# EasyEDA Pro project ProProject_开关电源实验平台_2024-07-17.epro, board PCB6
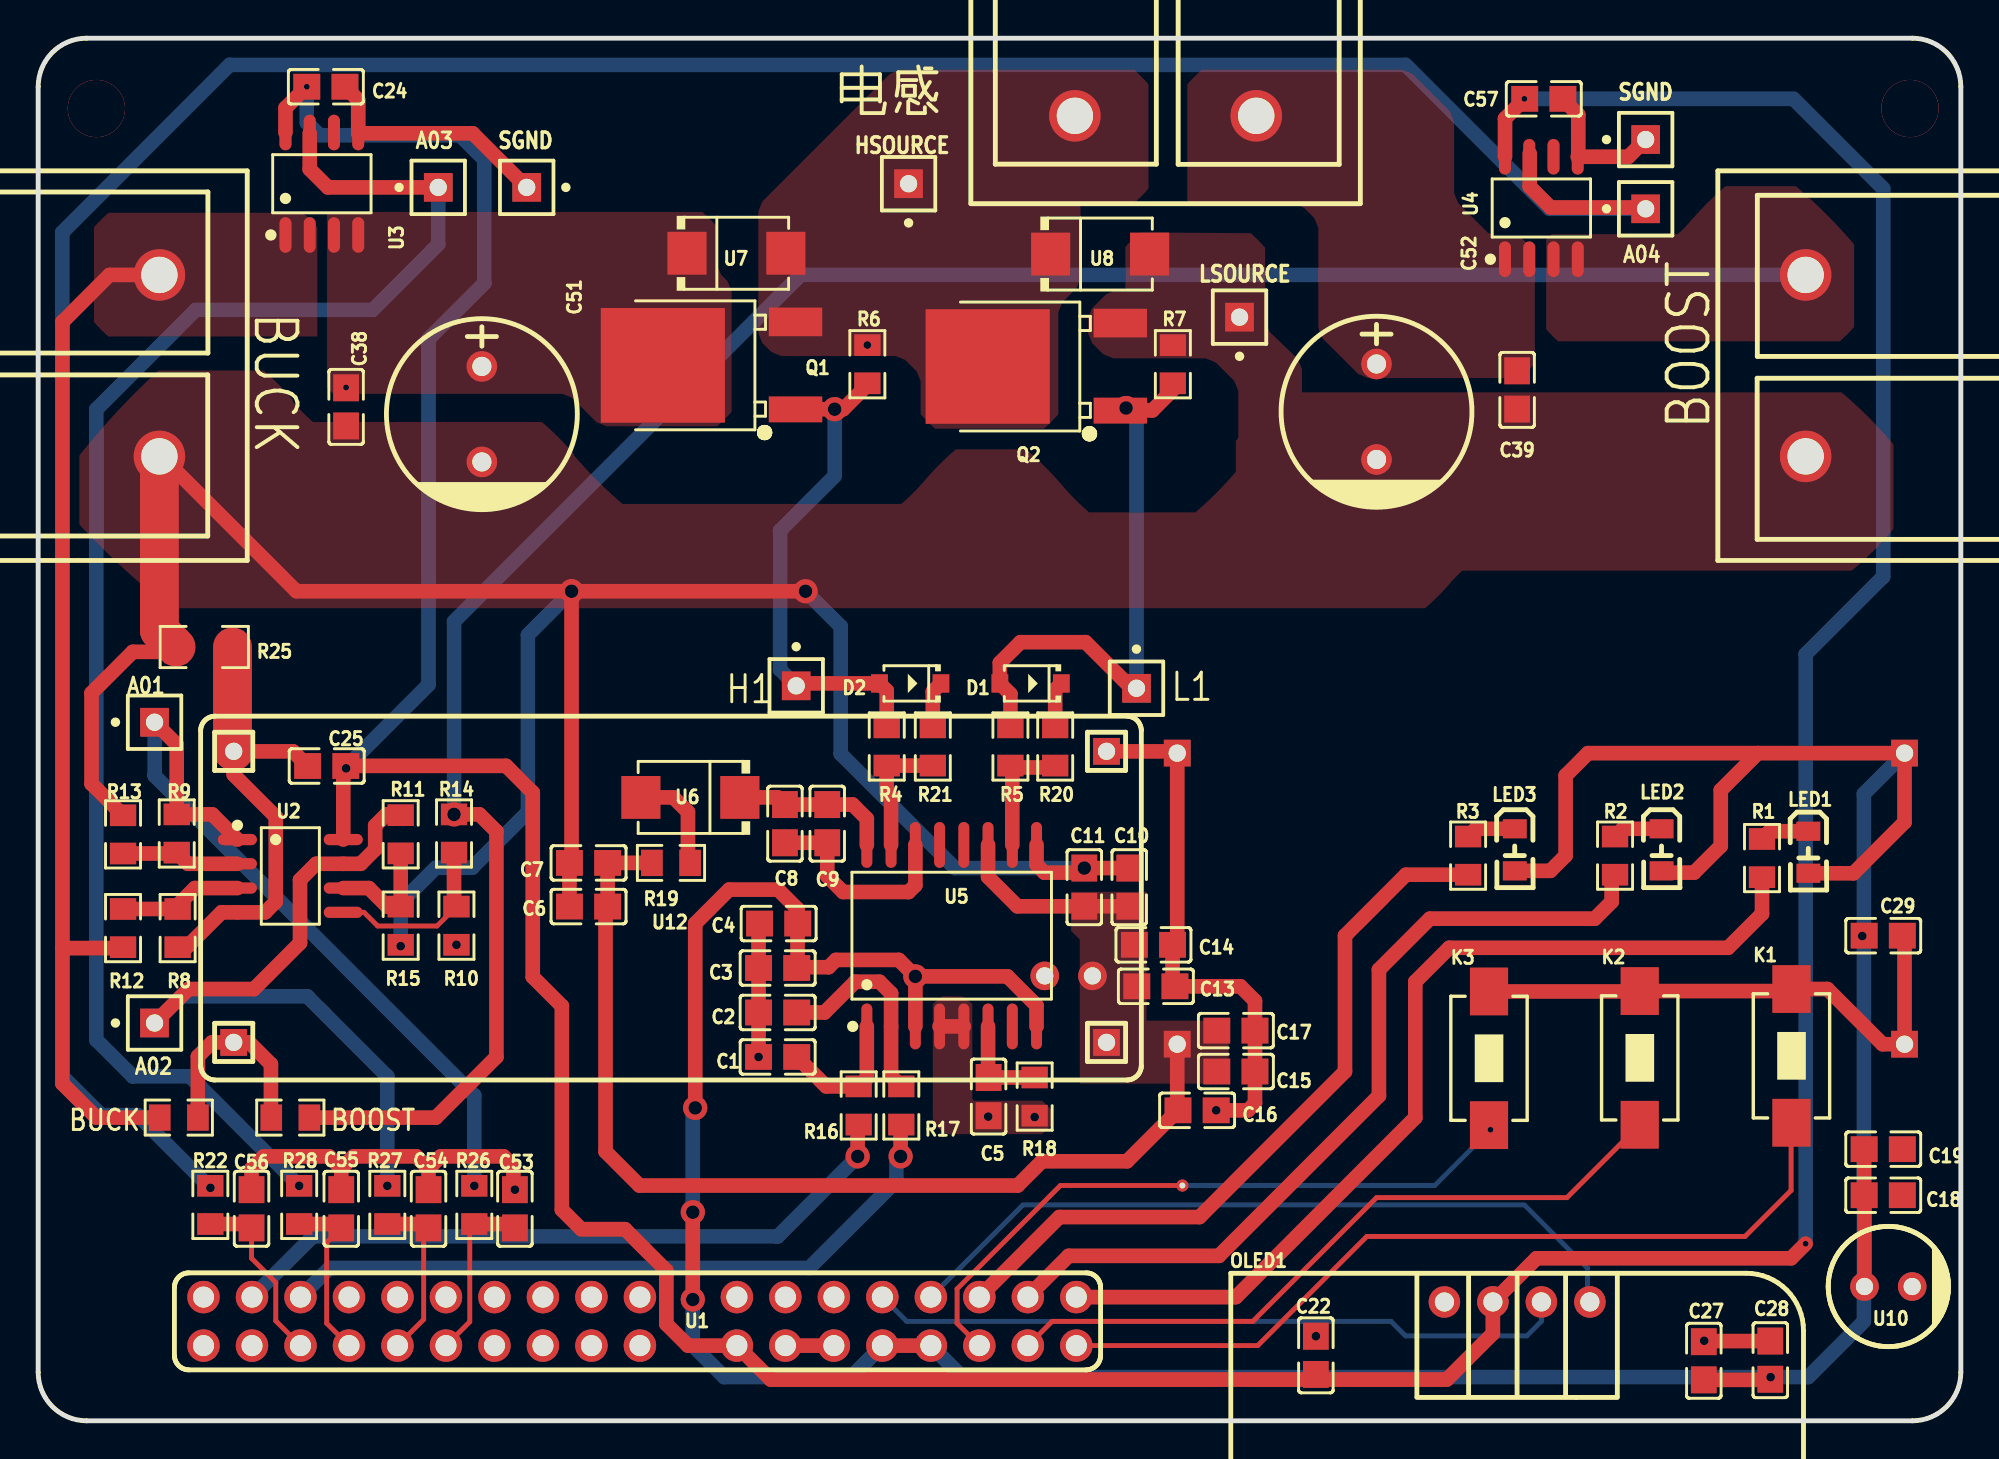
[diagram p8: board, top side]
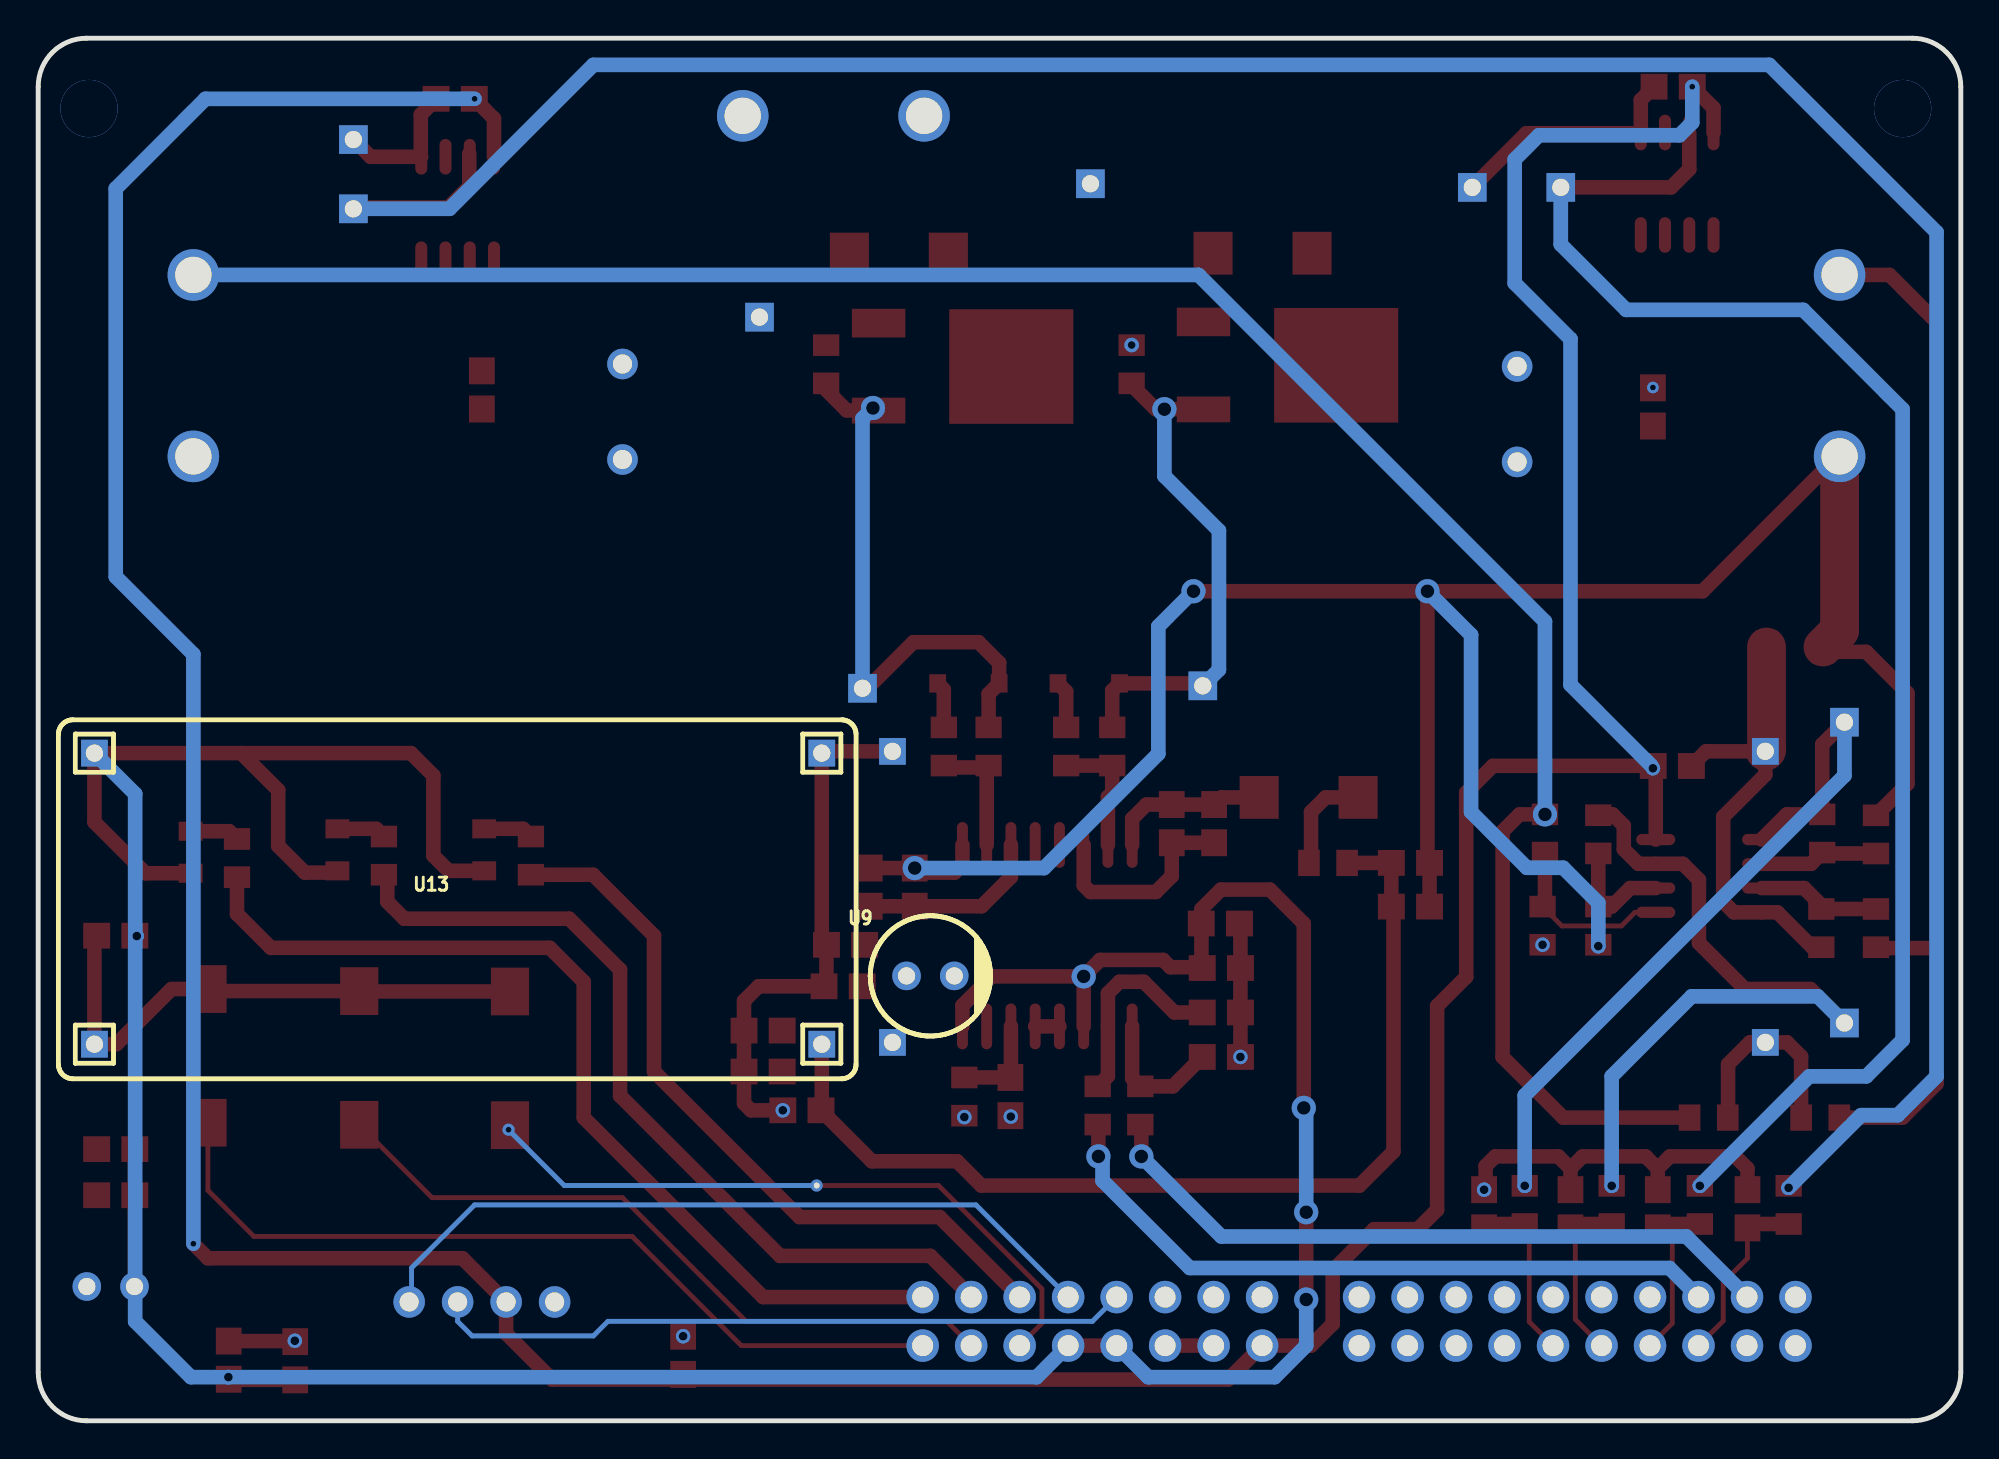
[diagram p9: board, bottom side, seen from below]

Outline 100.71 x 72.39 mm; copper layers: Top Layer, GND1, GND2, Bottom Layer. Coordinates in mm from the lower left corner of the outline.
Outline path: 0,69.85 0,2.54 arc(0.74,0.74) 2.54,0 98.17,0 arc(99.97,0.74) 100.71,2.54 100.71,69.85 arc(99.97,71.65) 98.17,72.39 2.54,72.39 arc(0.74,71.65) 0,69.85
Stack: Top Layer 0.035mm 外层铜厚1oz / Dielectric1 0.2104mm 7628 RC49% 8.6mil / GND1 0.0152mm 内层铜厚 / Dielectric2 1.065mm 1.1mm H/HOZ 含铜 / GND2 0.0152mm 内层铜厚 / Dielectric3 0.2104mm 7628 RC49% 8.6mil / Bottom Layer 0.035mm 外层铜厚1oz

## Design rules (mm)
template: JLCPCB Capability(Two Layers Board)
spacing copperThickness1oz (default): track to track 0.102, other pairs 0.152 to 0.3
spacing copperThickness2oz: track to track 0.203, other pairs 0.152 to 0.3
track width copperThickness1oz (default): min 0.127, default 0.254, max 2.54
track width copperThickness2oz: min 0.203, default 0.254, max 2.54
differential pair differentialPair (default): width min 0.127, default 0.254, max 2.54; gap min 0.152, default 0.152
via viaSize (default): diameter min 0.5, default 0.61, max 10; hole min 0.3, default 0.305, max 6.3

## Placement (name value [footprint] x y rotation side)
C1  33pF  [C0805]  38.73 19.05 180 top
C2  33pF  [C0805]  38.73 21.38 180 top
C3  100nF  [C0805]  38.73 23.71 180 top
C4  1uF  [C0805]  38.79 26.03 180 top
C5  3.3nF  [C0805]  49.78 16.98 90 top
C6  100nF  [C0805]  28.83 26.92 180 top
C7  1uF  [C0805]  28.83 29.21 180 top
C8  100nF  [C0805]  39.12 31.26 90 top
C9  1uF  [C0805]  41.33 31.26 90 top
C10  100nF  [C0805]  57.15 27.94 270 top
C11  1uF  [C0805]  54.8 27.94 270 top
C13  100nF  [C0805]  58.55 22.75 180 top
C14  100nF  [C0805]  58.42 24.92 180 top
C15  100nF  [C0805]  62.74 18.29 180 top
C16  100nF  [C0805]  60.71 16.26 180 top
C17  100nF  [C0805]  62.74 20.43 180 top
C18  100nF  [C0805]  96.65 11.81 180 top
C19  100nF  [C0805]  96.65 14.22 180 top
C22  100nF  [C0805]  66.93 3.43 270 top
C24  100nF  [C0805]  15.07 69.85 180 top
C25  100nF  [C0805]  15.11 34.28 0 top
C27  100nF  [C0805]  87.25 3.14 270 top
C28  100nF  [C0805]  90.73 3.18 270 top
C29  100nF  [C0805]  96.65 25.4 180 top
C38  100nF  [C0805]  16.13 53.09 270 top
C39  100nF  [C0805]  77.47 53.97 270 top
C51  100uF  [CAP-TH_BD10.0-P5.00-D0.6-FD]  23.24 52.7 270 top
C52  100uF  [CAP-TH_BD10.0-P5.00-D0.6-FD]  70.1 52.83 270 top
C53  10nF  [C0805]  24.97 11.1 90 top
C54  10nF  [C0805]  20.45 11.1 90 top
C55  10nF  [C0805]  15.88 11.1 90 top
C56  10nF  [C0805]  11.18 11.1 90 top
C57  100nF  [C0805]  78.87 69.22 180 top
D1  1N4148W  [SOD-123_L2.7-W1.6-LS3.7-FD]  51.98 38.61 0 top
D2  1N4148W  [SOD-123_L2.7-W1.6-LS3.7-FD]  45.68 38.61 0 top
IN1  DBT50B-9.5-2P-BK-P  [conn-th_dbt50b-9.5-2p]  6.35 55.25 270 top
K1  -  [sw_pb2_a1]  91.84 19.05 0 top
K2  -  [sw_pb2_a1]  83.89 18.94 0 top
K3  -  [sw_pb2_a1]  76 18.92 0 top
L1  1mH  [conn-th_dbt50b-9.5-2p]  59.05 68.33 180 top
LED1  -  [LED_0805]  92.72 29.72 270 top
LED2  -  [LED_0805]  85.03 29.84 270 top
LED3  -  [LED_0805]  77.34 29.84 270 top
NOREF  -  [Pad_e1035]  59.93 12.32 0 top
OLED1  -  [0.96OLED_4P]  77.47 6.22 0 top
OUT1  DBT50B-9.5-2P-BK-P  [conn-th_dbt50b-9.5-2p]  92.58 55.25 90 top
Q1  NCEP0178AK  [TO-252-2_L6.5-W6.1-P4.58-LS10.0-TL]  36.2 55.25 180 top
Q2  NCEP0178AK  [TO-252-2_L6.5-W6.1-P4.58-LS10.0-TL]  53.21 55.18 180 top
R1  510  [R0805]  90.3 29.46 270 top
R2  510  [R0805]  82.6 29.59 270 top
R3  510  [R0805]  74.9 29.59 270 top
R4  20  [R0805]  44.45 35.31 90 top
R5  20  [R0805]  50.93 35.31 90 top
R6  10K  [R0805]  43.43 55.32 270 top
R7  10K  [R0805]  59.44 55.32 270 top
R8  10K  [R0805]  7.31 25.8 270 top
R9  10K  [R0805]  7.26 30.75 270 top
R10  10K  [R0805]  21.91 25.92 270 top
R11  10K  [R0805]  18.99 30.71 270 top
R12  300K  [R0805]  4.45 25.8 90 top
R13  300K  [R0805]  4.45 30.7 270 top
R14  300K  [R0805]  21.78 30.75 270 top
R15  300K  [R0805]  18.99 25.92 90 top
R16  51  [R0805]  42.98 16.51 90 top
R17  51  [R0805]  45.21 16.51 90 top
R18  20K  [R0805]  52.2 16.98 90 top
R19  2.2  [R0805]  33.15 29.21 0 top
R20  0  [R0805]  53.27 35.31 90 top
R21  0  [R0805]  46.86 35.31 90 top
R22  1K  [R0805]  9.02 11.3 270 top
R23  0  [R0805]  7.37 15.88 180 top
R24  0  [R0805]  13.21 15.88 0 top
R25  0  [R1206]  8.7 40.51 180 top
R26  1K  [R0805]  22.84 11.3 270 top
R27  1K  [R0805]  18.29 11.3 270 top
R28  1K  [R0805]  13.67 11.3 270 top
TP1  -  [hdr1x1]  39.71 38.48 0 top
TP2  -  [hdr1x1]  57.53 38.35 0 top
TP3  -  [hdr1x1]  45.59 64.77 180 top
TP4  -  [hdr1x1]  62.93 57.78 180 top
TP6  -  [hdr1x1]  6.1 36.58 90 top
TP7  -  [hdr1x1]  6.1 20.83 90 top
TP8  -  [hdr1x1]  20.95 64.58 90 top
TP9  -  [hdr1x1]  25.59 64.58 270 top
TP10  -  [hdr1x1]  84.2 63.46 90 top
TP11  -  [hdr1x1]  84.2 67.08 90 top
U1  -  [竖插功率接口]  31.65 5.08 0 top
U2  SGM8632XS/TR  [SOIC-8_L4.9-W3.9-P1.27-LS6.0-BL]  13.21 28.53 270 top
U3  CC6903SO-10A  [SOP-8_L4.9-W3.9-P1.27-LS6.0-BL]  14.86 64.77 0 top
U4  CC6903SO-10A  [SOP-8_L4.9-W3.9-P1.27-LS6.0-BL]  78.74 63.5 0 top
U5  UCC21520DWR  [SOIC-16_L10.3-W7.5-P1.27-LS10.3-BL]  47.85 25.4 0 top
U6  SS510B  [SMB_L4.6-W3.5-LS5.3-RD]  34.16 32.64 180 top
U7  SS510B  [SMB_L4.6-W3.5-LS5.3-RD]  36.58 61.13 0 top
U8  SS510B  [SMB_L4.6-W3.5-LS5.3-RD]  55.63 61.09 0 top
U9  220uF  [CAP-TH_BD6.3-P2.50-D0.5-FD]  53.98 23.29 180 bottom
U10  220uF  [CAP-TH_BD6.3-P2.50-D0.5-FD]  96.91 7.03 0 top
U12  -  [12V辅助电源-LM5164]  32.47 26.42 0 top
U13  -  [5V辅助电源-SY8401]  80.26 27.18 0 bottom

## Footprints (pads in the part's own frame, mm; a bottom-side part is the same pattern mirrored in y, then rotated)
0.96OLED_4P
  round 1.65 hole 1: 1(-3.81,-0.002) 2(-1.27,0.002) 3(1.27,0.002) 4(3.81,0.002)
5V辅助电源-SY8401
  rect 1.4x1.4 hole 0.9: 1(-20.599,7.46) 2(-20.599,-7.78) 3(17.5,-7.78) 4(17.5,7.46)
12V辅助电源-LM5164
  rect 1.4x1.4 hole 0.9: 1(-22.225,-6.604) 2(-22.225,8.636) 3(23.495,-6.604) 4(23.495,8.636)
C0805
  rect 1.41x1.35 smd: 1(-1,0) 2(1,0)
CAP-TH_BD6.3-P2.50-D0.5-FD
  round 1.5 hole 0.9: 1(-1.25,0) 2(1.25,0)
CAP-TH_BD10.0-P5.00-D0.6-FD
  round 1.6 hole 1: 1(-2.5,0) 2(2.5,0)
conn-th_dbt50b-9.5-2p
  round 2.7 hole 1.9: 1(-4.75,0) 2(4.75,0)
hdr1x1
  rect 1.5x1.5 hole 0.9: 1(0,0)
LED_0805
  rect 1x1.25 smd: 1(-1.15,0.005) 2(1.05,0.005)
Pad_e1035
  round 0.635 hole 0.305: 31(0,0)
R0805
  rect 1.133x1.377 smd: 1(-1,0) 2(1,0)
R1206
  rect 1.208x1.701 smd: 1(-1.479,0) 2(1.479,0)
SMB_L4.6-W3.5-LS5.3-RD
  rect 2.047x2.241 smd: 1(-2.591,0) 2(2.591,0)
SOD-123_L2.7-W1.6-LS3.7-FD
  rect 0.88x0.96 smd: 1(-1.61,0) 2(1.61,0)
SOIC-8_L4.9-W3.9-P1.27-LS6.0-BL
  oval 0.588x2.045 smd: 1(-1.905,-2.772) 2(-0.635,-2.772) 3(0.635,-2.772) 4(1.905,-2.772) 5(1.905,2.772) 6(0.635,2.772) 7(-0.635,2.772) 8(-1.905,2.772)
SOIC-16_L10.3-W7.5-P1.27-LS10.3-BL
  oval 0.574x2.401 smd: 1(-4.445,-4.75) 2(-3.175,-4.75) 3(-1.905,-4.75) 4(-0.635,-4.75) 5(0.635,-4.75) 6(1.905,-4.75) 7(3.175,-4.75) 8(4.445,-4.75) 9(4.445,4.75) 10(3.175,4.75) 11(1.905,4.75) 12(0.635,4.75) 13(-0.635,4.75) 14(-1.905,4.75) 15(-3.175,4.75) 16(-4.445,4.75)
SOP-8_L4.9-W3.9-P1.27-LS6.0-BL
  oval 0.63x1.865 smd: 1(-1.905,-2.683) 2(-0.635,-2.683) 3(0.635,-2.683) 4(1.905,-2.683) 5(1.905,2.683) 6(0.635,2.683) 7(-0.635,2.683) 8(-1.905,2.683)
sw_pb2_a1
  rect 2x2.5 smd: 1(0,3.556) 2(0,-3.444)
TO-252-2_L6.5-W6.1-P4.58-LS10.0-TL
  rect 2.8x1.35 smd: 1(-3.475,2.29)
  rect 2.8x1.5 smd: 3(-3.475,-2.29)
  rect 6.5x6 smd: 4(3.475,-0.017)
竖插功率接口
  round 1.7 hole 1.1: 1(-22.987,-1.143) 2(-20.447,-1.143) 3(-17.907,-1.143) 4(-15.367,-1.143) 5(-12.827,-1.143) 6(-10.287,-1.143) 7(-7.747,-1.143) 8(-5.207,-1.143) 9(-2.667,-1.143) 10(-0.127,-1.143) 11(-22.987,1.397) 12(-20.447,1.397) 13(-17.907,1.397) 14(-15.367,1.397) 15(-12.827,1.397) 16(-10.287,1.397) 17(-7.747,1.397) 18(-5.207,1.397) 19(-2.667,1.397) 20(-0.127,1.397) 21(4.953,-1.143) 22(7.493,-1.143) 23(10.033,-1.143) 24(12.573,-1.143) 25(15.113,-1.143) 26(4.953,1.397) 27(7.493,1.397) 28(10.033,1.397) 29(12.573,1.397) 30(15.113,1.397) 41(17.653,-1.143) 42(20.193,-1.143) 43(22.733,-1.143) 44(17.653,1.397) 45(20.193,1.397) 46(22.733,1.397)

## Nets
+3.3V: C22.2 C24.2 C25.2 C57.2 OLED1.2 U1.21 U2.8 U3.8 U4.8
+5V: C3.1 C4.1 C18.2 C19.2 C27.2 C28.2 C29.2 LED1.2 LED2.2 LED3.2 U1.24 U1.25 U5.3 U5.8 U10.1 U13.3
+12V: C6.1 C7.1 C10.2 C11.2 C13.2 C14.2 C15.2 C16.2 C17.2 R19.1 U5.11 U9.1 U12.3 U13.1
+30V: IN1.1 R12.1 R23.2 U3.1 U3.2
GND: C1.2 C2.2 C3.2 C4.2 C5.1 C13.1 C14.1 C15.1 C16.1 C17.1 C18.1 C19.1 C22.1 C24.1 C25.1 C27.1 C28.1 C29.1 C53.2 C54.2 C55.2 C56.2 C57.1 K1.1 K2.1 K3.1 OLED1.1 R8.2 R10.2 R18.1 R25.1 TP9.1 TP11.1 U1.22 U1.23 U2.4 U3.5 U4.5 U5.4 U5.5 U9.2 U10.2 U12.2 U12.4 U13.2 U13.4
PGND: C6.2 C7.2 C10.1 C11.1 C38.2 C39.2 C51.2 C52.2 IN1.2 OUT1.1 Q2.3 R7.1 R13.1 R15.1 R25.2 TP4.1 U5.9 U8.2
VIN: C38.1 C51.1 Q1.4 U3.3 U3.4 U7.1
ADOUT1: C53.1 R26.2 U1.6
ADOUT2: C54.1 R27.2 U1.5
ADOUT3: C55.1 R28.2 U1.4
ADOUT4: C56.1 R22.2 U1.3
H1: D2.1 Q1.1 R4.2 R6.2 TP1.1
I2C_SCL: OLED1.3 U1.29
I2C_SDA: OLED1.4 U1.30
KEY1: K1.2 U1.43
KEY2: K2.2 U1.42
KEY3: K3.2 NOREF.31 U1.41
L1: D1.1 Q2.1 R5.2 R7.2 TP2.1
LED1: R1.2 U1.46
LED2: R2.2 U1.45
LED3: R3.2 U1.44
OUT: C39.1 C52.1 L1.1 U4.1 U4.2
OUT1: L1.2 Q1.3 Q2.4 R6.1 TP3.1 U7.2 U8.1
PADOUT1: R9.1 R26.1 TP6.1 U2.1
PADOUT2: R11.1 R27.1 TP7.1 U2.7
PADOUT3: R28.1 TP8.1 U3.7
PADOUT4: R22.1 TP10.1 U4.7
PWM7A: R16.1 U1.12
PWM7B: R17.1 U1.13
SPWMH1: R4.1 R21.1 U5.15
SPWML1: R5.1 R20.1 U5.10
VA: R23.1 R24.1 U12.1
VOUT: OUT1.2 R14.1 R24.2 U4.3 U4.4
$1N1372: R8.1 R12.2 U2.3
$1N1373: R9.2 R13.2 U2.2
$1N1376: R10.1 R14.2 U2.5
$1N1377: R11.2 R15.2 U2.6
$1N2711: C1.1 R16.2 U5.1
$1N2718: C2.1 R17.2 U5.2
$1N2906: C5.2 R18.2 U5.6
$1N3035: R19.2 U6.2
$1N3348: C8.2 C9.2 U5.16 U6.1
$1N3355: C8.1 C9.1 U5.14
$1N3716: D1.2 R20.2
$1N3823: D2.2 R21.2
$1N4944: LED1.1 R1.1
$1N4945: LED2.1 R2.1
$1N4946: LED3.1 R3.1

Pads without a net: U1 1 2 7 8 9 10 11 14 15 16 17 18 19 20 26 27 28; U3 6; U4 6; U5 7 12 13

## Via types
v1: diameter 3, hole 3, Top Layer to Bottom Layer, 2 vias
v2: diameter 0.61, hole 0.305, Top Layer to Bottom Layer, 4 vias
v3: diameter 0.762, hole 0.457, Top Layer to Bottom Layer, 16 vias
v4: diameter 1.27, hole 0.711, Top Layer to Bottom Layer, 12 vias
v5: diameter 0.762, hole 0.406, Top Layer to Bottom Layer, 1 via
v6: diameter 0.635, hole 0.305, Top Layer to Bottom Layer, 1 via

## Routing (per net, layer and track width the routed paths; a pad name or vN(x,y) marks a point on that pad's centre or on a via; arc(x,y) is an arc through that point)
+3.3V: length 241.8
  Top Layer w0.762: U3.8 12.95,68.73 v2(14.07,69.85) ; U2.8 15.98,34.15 C25.2 16.12,34.29 24.51,34.29 25.91,32.89 25.91,23.24 27.43,21.72 27.43,11.05 28.45,10.03 30.73,10.03 32.9,7.86 32.9,5.07 34.04,3.94 U1.21 38.38,2.16 73.79,2.16 76.2,4.57 OLED1.2 78.48,8.51 91.82,8.51 v2(92.58,9.27) ; C57.2 76.83,68.18 U4.8
  Bottom Layer w0.762: v2(92.58,9.27) 92.58,40.13 96.65,44.2 96.65,64.52 91.95,69.22 v2(77.85,69.22) ; v2(14.07,69.85) 14.07,67.97 14.73,67.31 22.1,67.31 23.37,66.04 23.37,59.56 20.45,56.64 20.45,38.54 16.21,34.3
  vias: v3(16.13,34.16)
+5V: length 199.7
  Top Layer w0.762: v4(45.95,23.27) 50.77,23.27 52.3,21.74 U5.8 ; v4(45.95,23.27) 45.08,24.13 41.78,24.13 41.4,23.75 39.78,23.75 ; v4(45.95,23.27) U5.3 ; 90.08,34.96 88.14,33.02 88.14,30.1 86.74,28.7 85.13,28.7 LED2.2 ; 90.08,34.96 U13.3 97.76,31.34 95.09,28.67 LED1.2 ; 90.08,34.96 81.19,34.96 80.01,33.78 80.01,29.59 79.21,28.8 LED3.2 ; U10.1 95.66,11.79 C18.2 C19.2 ; C28.2 90.7,2.14 C27.2 ; 39.78,26.03 39.78,26.79 38.76,27.81 36.2,27.81 34.42,26.03 v4(34.42,16.38) ; 39.78,26.03 C4.1 ; 39.78,26.03 39.78,23.75 ; U1.24 U1.25 ; v4(34.29,10.92) v4(34.29,6.35) ; 39.78,23.75 C3.1
  Bottom Layer w0.762: U1.24 42.57,2.29 35.94,2.29 34.29,3.94 v4(34.29,6.35) ; U1.25 48.41,2.29 v3(90.75,2.29) 92.71,2.29 95.63,5.21 95.63,32.82 U13.3 ; v4(34.42,16.38) 34.29,16.26 v4(34.29,10.92)
  vias: v3(95.55,25.38)
+12V: length 63
  Top Layer w0.762: R19.1 C7.1 C6.1 29.72,26.81 29.72,14.1 31.5,12.32 51.31,12.32 52.58,13.59 57.04,13.59 C16.2 59.66,16.3 U13.1 ; C10.2 C11.2 51.29,26.94 49.76,28.48 U5.11
+30V: length 55
  Top Layer w0.762: 1.27,24.75 4.4,24.75 R12.1 ; 1.27,24.75 1.27,57.53 3.73,60 IN1.1 ; 1.27,24.75 1.27,17.65 3.05,15.88 R23.2
GND: length 135.5
  Top Layer w0.762: C27.1 87.28,4.18 C28.1 ; U12.4 59.57,35.05 U13.2 59.66,25.17 C14.1 59.42,22.88 C13.1 62.98,22.75 63.74,21.99 C17.1 C15.1 63.74,16.62 63.37,16.26 v3(61.71,16.26) ; K3.1 83.87,22.48 K2.1 91.73,22.5 K1.1 93.73,22.61 96.61,19.72 U13.4 97.76,25.28 C29.1 ; 15.88,13.21 16.51,13.84 19.81,13.84 20.45,13.21 ; 15.88,13.21 15.24,13.84 11.81,13.84 11.18,13.21 C56.2 ; 15.88,13.21 C55.2 ; TP9.1 22.76,67.41 16.76,67.41 ; 20.45,13.21 C54.2 ; 20.45,13.21 21.08,13.84 24.38,13.84 24.89,13.33 24.89,12.18 v3(24.97,12.1) ; 80.67,66.35 80.67,68.39 79.87,69.19 C57.1 ; R8.2 7.78,24.8 9.6,26.62 U2.4 11.89,26.62 12.45,27.18 12.45,31.62 10.24,33.83 U12.2 13.34,35.05 C25.1 ; U1.22 U1.23 ; v3(37.73,19.05) C2.2 C3.2 37.73,25.98 C4.2 ; TP11.1 83.3,66.18 U4.5 ; U3.5 16.76,69.16 C24.1 ; U5.4 U5.5
  Top Layer w2.032: R25.1 10.18,35.12 U12.2
  vias: v3(21.91,24.92) v3(49.76,15.93) v3(52.2,15.9) v3(66.93,4.43) v3(87.27,4.19)
PGND: length 130.2
  Top Layer w0.762: v4(27.94,43.43) 27.94,43.69 ; v4(27.94,43.43) 13.53,43.43 6.6,50.36 ; v4(27.94,43.43) v4(40.2,43.43) ; v4(27.94,43.43) 27.94,29.32 C7.2 C6.2 ; 7.22,40.51 6.97,40.26 4.95,40.26 2.79,38.1 2.79,33.35 R13.1 ; C10.1 v4(54.8,28.94) 54.56,28.7 52.7,28.7 52.3,29.11 U5.9
  Top Layer w2.032: 7.22,40.51 6.35,41.38 IN1.2
  Bottom Layer w0.762: v4(40.2,43.43) 42.04,41.59 42.04,34.92 48.02,28.94 v4(54.8,28.94) ; v3(18.99,24.85) 18.99,27.12 20.83,28.96 22.73,28.96 25.65,31.88 25.65,41.15 v4(27.94,43.43)
VIN:
  vias: v2(16.13,54.1)
(no net):
  vias: v1(3.05,68.71) v1(98.05,68.71)
ADOUT1: length 9.2
  Top Layer w0.254: U1.6 22.61,5.18 22.61,10.06 R26.2
  Top Layer w0.762: C53.1 24.77,10.3 R26.2
ADOUT2: length 9.1
  Top Layer w0.254: C54.1 20.19,9.85 20.19,5.31 U1.5
  Top Layer w0.762: R27.2 20.24,10.3 C54.1
ADOUT3: length 9.3
  Top Layer w0.254: C55.1 15.11,9.34 15.11,5.1 U1.4
  Top Layer w0.762: C55.1 15.67,10.3 R28.2
ADOUT4: length 9.5
  Top Layer w0.254: 13.74,3.94 12.45,5.23 12.45,7.24 11.18,8.51 C56.1
  Top Layer w0.762: C56.1 10.97,10.3 R22.2
H1: length 27.4
  Top Layer w0.762: 43.44,54.23 42.17,52.97 v4(41.72,52.97) 39.45,52.97 ; R4.2 44.45,38.23 D2.1 39.83,38.61 TP1.1
  Bottom Layer w0.762: v4(41.72,52.97) 41.72,49.47 38.86,46.61 38.86,39.33 TP1.1
I2C_SCL: length 36.7
  Bottom Layer w0.254: 78.74,6.22 78.74,5.21 77.98,4.44 71.63,4.44 70.87,5.21 45.49,5.21 U1.29
I2C_SDA: length 39.6
  Bottom Layer w0.254: 81.28,6.22 81.15,6.35 81.15,8 77.85,11.3 51.59,11.3 U1.30
KEY1: length 44.4
  Top Layer w0.254: U1.43 63.88,3.94 69.6,9.65 89.41,9.65 91.82,12.06 91.82,15.59 K1.2
KEY2: length 36.8
  Top Layer w0.254: K2.2 80.08,11.68 70.1,11.68 63.63,5.21 53.11,5.21 51.84,3.94
KEY3: length 34.8
  Top Layer w0.254: U1.41 48.13,5.1 48.13,6.91 53.55,12.32 NOREF.31
  Bottom Layer w0.254: NOREF.31 73.15,12.32 v6(76.07,15.24)
L1: length 31
  Top Layer w0.762: 55.96,52.9 58.36,52.9 59.44,53.97 ; TP2.1 57.28,38.35 54.86,40.77 51.45,40.77 50.37,39.69 D1.1 50.93,38.05 R5.2
  Bottom Layer w0.762: v4(56.98,53.03) 57.53,52.48 TP2.1
LED1: length 50.3
  Top Layer w0.762: R1.2 90.3,26.54 88.52,24.77 73.91,24.77 72.14,22.99 72.14,15.88 62.74,6.48 U1.46
LED2: length 44.5
  Top Layer w0.762: R2.2 82.42,28.42 82.42,27.18 81.53,26.29 72.9,26.29 70.23,23.62 70.23,17.02 61.85,8.64 53.98,8.64 51.84,6.5 51.84,6.48
LED3: length 38.9
  Top Layer w0.762: R3.2 71.64,28.59 68.45,25.4 68.45,18.29 60.83,10.67 53.49,10.67 U1.44
OUT1:
  vias: v5(43.43,56.32)
PADOUT1: length 40.2
  Top Layer w0.762: U2.1 9.12,31.75 R9.1 7.26,35.41 TP6.1
  Bottom Layer w0.762: TP6.1 6.1,33.78 22.84,17.03 v3(22.84,12.3)
PADOUT2: length 40.3
  Top Layer w0.762: TP7.1 7.87,22.61 11.3,22.61 13.72,25.02 13.72,28.32 14.56,29.16 U2.7 16.89,29.16 17.65,29.92 17.65,31.16 18.24,31.75 18.95,31.75 R11.1
  Bottom Layer w0.762: TP7.1 7.49,22.22 14.1,22.22 18.29,18.03 v3(18.29,12.3)
PADOUT3: length 80.3
  Top Layer w0.762: 14.22,67.41 14.22,65.53 15.18,64.58 TP8.1
  Bottom Layer w0.762: v3(13.67,12.3) 7.94,18.03 4.95,18.03 3.05,19.94 3.05,52.96 8.25,58.17 17.53,58.17 20.95,61.59 TP8.1
PADOUT4: length 152.3
  Top Layer w0.762: 78.13,66.35 78.13,64.62 79.22,63.53 84.23,63.53
  Bottom Layer w0.762: TP10.1 79.16,63.46 71.63,70.99 10.03,70.99 1.27,62.23 1.27,18.03 3.3,16 5.22,16 v3(9.02,12.2)
PWM7A: length 36.5
  Top Layer w0.762: v4(42.93,13.84) 42.93,15.46 R16.1
  Bottom Layer w0.762: v4(42.93,13.84) 38.73,9.65 14.38,9.65 U1.12
PWM7B: length 36.8
  Top Layer w0.762: v4(45.17,13.84) 45.17,15.47 R17.1
  Bottom Layer w0.762: 13.74,6.48 15.26,8 40.39,8 44.96,12.57 44.96,13.63 v4(45.17,13.84)
SPWMH1: length 6.7
  Top Layer w0.762: U5.15 44.68,32.67 44.45,32.89 R4.1 R21.1
SPWML1: length 6.5
  Top Layer w0.762: U5.10 51.03,34.21 ; 51.03,34.21 R5.1 ; 51.03,34.21 53.17,34.21 R20.1
VA: length 11.1
  Top Layer w0.762: 8.37,15.62 8.37,19.08 9.1,19.81 U12.1 11.05,19.81 12.19,18.67 12.19,15.89 ; 12.19,15.89 R24.1 ; 12.19,15.89 12.19,15.64
VOUT: length 113.9
  Top Layer w0.762: R24.2 20.83,15.88 24,19.05 24,30.86 23.11,31.75 v4(21.78,31.75)
  Bottom Layer w0.762: OUT1.2 39.93,60 21.78,41.85 v4(21.78,31.75)
$1N1372: length 6.6
  Top Layer w0.762: U2.3 8.21,27.89 7.31,26.99 R8.1 R12.2
$1N1373: length 6.3
  Top Layer w0.762: U2.2 7.85,29.16 R9.2 7.21,29.7 R13.2
$1N1376: length 9.5
  Top Layer w0.254: R10.1 20.89,25.91 17.78,25.91 17.07,26.62 U2.5
  Top Layer w0.762: R14.2 21.78,27.05 R10.1
$1N1377: length 6.2
  Top Layer w0.762: R11.2 R15.2 18.29,26.92 17.32,27.89 U2.6
$1N2711: length 7.2
  Top Layer w0.762: U5.1 43.41,17.94 R16.2 41.27,17.51 C1.1
$1N2718: length 11
  Top Layer w0.762: C2.1 41.19,21.38 42.8,22.99 44.07,22.99 44.68,22.38 U5.2 44.68,18.05 R17.2
$1N2906: length 5.1
  Top Layer w0.762: U5.6 49.76,18 C5.2 R18.2
$1N3035: length 5.5
  Top Layer w0.762: R19.2 34.04,29.32 34.04,31.88 33.27,32.64 U6.2
$1N3348: length 8.5
  Top Layer w0.762: U6.1 38.74,32.64 C8.2 C9.2 42.67,32.26 43.41,31.52 U5.16
$1N3355: length 11.2
  Top Layer w0.762: C8.1 C9.1 41.33,28.52 42.16,27.69 45.59,27.69 45.95,28.04 U5.14
$1N3716: length 2.4
  Top Layer w0.762: R20.2 53.27,38.29 D1.2
$1N3823: length 2.5
  Top Layer w0.762: R21.2 46.86,38.18 D2.2
$1N4944: length 2.6
  Top Layer w0.762: 92.73,30.87 90.7,30.87 R1.1
$1N4945: length 2.6
  Top Layer w0.762: R2.1 83,31 LED2.1
$1N4946: length 2.6
  Top Layer w0.762: R3.1 75.31,31 LED3.1

## Copper pours and planes (outline as drawn; the poured copper is in the pictures)
+12V on Top Layer: 54.1,27.7 62.36,27.7 62.36,17.65 54.1,17.65
+30V on Top Layer: 2.92,63.25 14.62,63.25 14.62,56.77 2.92,56.77
GND on Top Layer: 46.86,22.22 53.09,22.22 53.09,15.01 46.86,15.01
GND on GND1: 0.26,72.13 100.45,72.13 100.45,0.26 0.26,0.26
GND on GND2: 0.26,72.13 100.45,72.13 100.45,0.26 0.26,0.26
PGND on Top Layer: 54.99,62.22 66.2,62.22 66.2,48.54 54.99,48.54
PGND on Top Layer: 2.16,54.99 97.19,54.99 97.19,42.55 2.16,42.55
VIN on Top Layer: 15.13,63.29 36.32,63.29 36.32,52.07 15.13,52.07
OUT on Top Layer: 60.2,70.74 78.4,70.74 78.4,54.59 60.2,54.59
OUT1 on Top Layer: 37.72,70.74 58.16,70.74 58.16,51.94 37.72,51.94
VOUT on Top Layer: 78.99,64.64 95.12,64.64 95.12,56.52 78.99,56.52
GND on Top Layer: 3.81,0.76 3.27,0.99 3.05,1.52 3.05,38.14 3.27,38.68 3.81,38.9 25.27,38.9 25.81,38.68 26.03,38.14 26.03,15.94 26.09,15.65 26.26,15.4 30.13,11.53 30.38,11.36 30.67,11.3 68.01,11.3 68.3,11.36 68.55,11.53 72.8,15.78 72.97,16.03 73.02,16.32 73.02,36.19 73.28,36.45 98.81,36.45 99.34,36.23 99.57,35.69 99.57,1.52 99.34,0.99 98.81,0.76

Small or netless copper shapes (teardrops, artwork), in the pictures only: 44 on GND1, 44 on GND2

## Text on the board
Top Silkscreen Layer: A01 | A02 | A03 | A04 | SGND | HSOURCE | LSOURCE | BUCK | BOOST | H1 | L1 | 电感
